# Altium schematic sheet schema.SchDoc
size A4
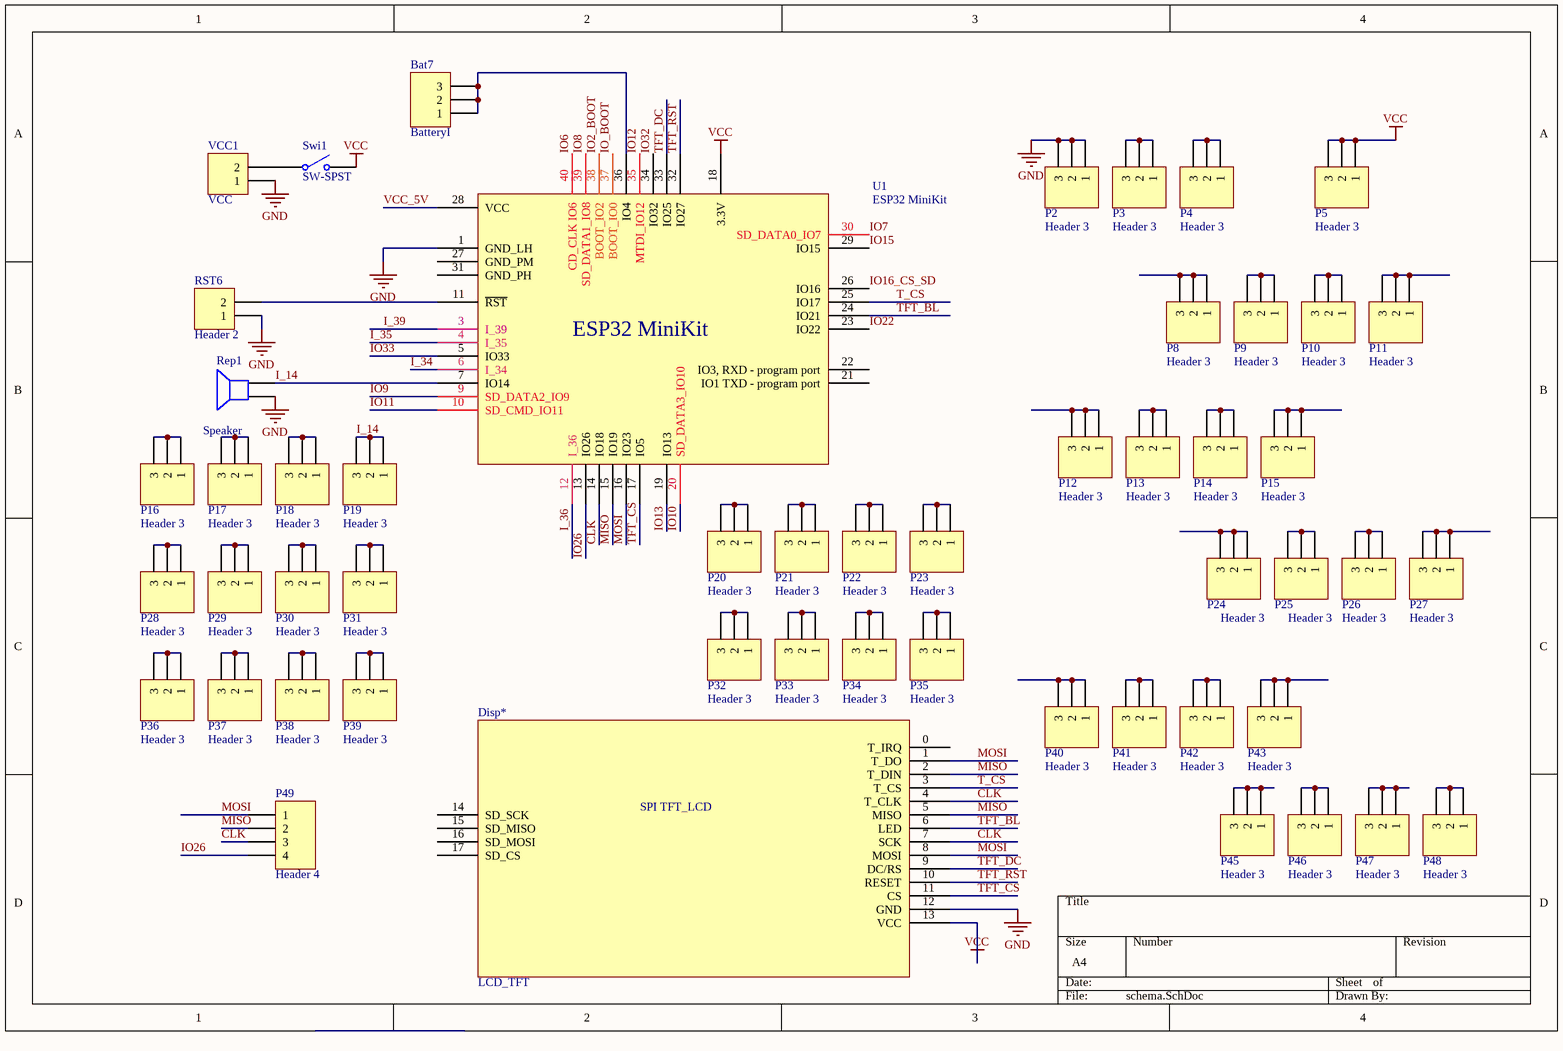
[diagram p0: schema.SchDoc]

## Parts
Bat7  BatteryI  [HDR1X3]
Disp*  LCD_TFT  [TCT_SPI_480x320 ST7796]
P2  Header 3  [HDR1X3]
P3  Header 3  [HDR1X3]
P4  Header 3  [HDR1X3]
P5  Header 3  [HDR1X3]
P8  Header 3  [HDR1X3]
P9  Header 3  [HDR1X3]
P10  Header 3  [HDR1X3]
P11  Header 3  [HDR1X3]
P12  Header 3  [HDR1X3]
P13  Header 3  [HDR1X3]
P14  Header 3  [HDR1X3]
P15  Header 3  [HDR1X3]
P16  Header 3  [HDR1X3]
P17  Header 3  [HDR1X3]
P18  Header 3  [HDR1X3]
P19  Header 3  [HDR1X3]
P20  Header 3  [HDR1X3]
P21  Header 3  [HDR1X3]
P22  Header 3  [HDR1X3]
P23  Header 3  [HDR1X3]
P24  Header 3  [HDR1X3]
P25  Header 3  [HDR1X3]
P26  Header 3  [HDR1X3]
P27  Header 3  [HDR1X3]
P28  Header 3  [HDR1X3]
P29  Header 3  [HDR1X3]
P30  Header 3  [HDR1X3]
P31  Header 3  [HDR1X3]
P32  Header 3  [HDR1X3]
P33  Header 3  [HDR1X3]
P34  Header 3  [HDR1X3]
P35  Header 3  [HDR1X3]
P36  Header 3  [HDR1X3]
P37  Header 3  [HDR1X3]
P38  Header 3  [HDR1X3]
P39  Header 3  [HDR1X3]
P40  Header 3  [HDR1X3]
P41  Header 3  [HDR1X3]
P42  Header 3  [HDR1X3]
P43  Header 3  [HDR1X3]
P45  Header 3  [HDR1X3]
P46  Header 3  [HDR1X3]
P47  Header 3  [HDR1X3]
P48  Header 3  [HDR1X3]
P49  Header 4  [HDR1X4]
Rep1  Speaker  [PIN2]
RST6  Header 2  [HDR1X2]
Swi1  SW-SPST  [SPST-2]
U1  ESP32 MiniKit  [esp32]
VCC1  VCC  [HDR1X2]

## Nets
GND: Disp*.12(GND) P2.1 P2.2 P2.3 Rep1.1 RST6.1 U1.1(GND_LH) VCC1.1
VCC: Disp*.13(VCC) P5.1 P5.2 P5.3 Swi1.2(NO) U1.18(3.3V)
CLK: Disp*.4(T_CLK) Disp*.7(SCK) P49.3 U1.14(IO18)
I_14: P19.1 P19.2 P19.3 Rep1.2 U1.7(IO14)
I_34: U1.6(I_34)
I_35: U1.4(I_35)
I_36: U1.12(I_36)
I_39: U1.3(I_39)
IO2_BOOT: U1.38(BOOT_IO2)
IO6: U1.40(CD_CLK_IO6)
IO7: U1.30(SD_DATA0_IO7)
IO8: U1.39(SD_DATA1_IO8)
IO9: U1.9(SD_DATA2_IO9)
IO10: U1.20(SD_DATA3_IO10)
IO11: U1.10(SD_CMD_IO11)
IO12: U1.35(MTDI_IO12)
IO13: U1.19(IO13)
IO15: U1.29(IO15)
IO16_CS_SD: U1.26(IO16)
IO22: U1.23(IO22)
IO26: P49.4 U1.13(IO26)
IO32: U1.34(IO32)
IO33: U1.5(IO33)
IO_BOOT: U1.37(BOOT_IO0)
MISO: Disp*.2(T_DIN) Disp*.5(MISO) P49.2 U1.15(IO19)
MOSI: Disp*.1(T_DO) Disp*.8(MOSI) P49.1 U1.16(IO23)
T_CS: Disp*.3(T_CS) U1.25(IO17)
TFT_BL: Disp*.6(LED) U1.24(IO21)
TFT_CS: Disp*.11(CS) U1.17(IO5)
TFT_DC: Disp*.9(DC/RS) U1.33(IO25)
TFT_RST: Disp*.10(RESET) U1.32(IO27)
VCC_5V: U1.28(VCC)
NetBat7_1: Bat7.1 Bat7.2 Bat7.3 U1.36(IO4)
NetP3_1: P3.1 P3.2 P3.3
NetP4_1: P4.1 P4.2 P4.3
NetP8_1: P8.1 P8.2 P8.3
NetP9_1: P9.1 P9.2 P9.3
NetP10_1: P10.1 P10.2 P10.3
NetP11_1: P11.1 P11.2 P11.3
NetP12_1: P12.1 P12.2 P12.3
NetP13_1: P13.1 P13.2 P13.3
NetP14_1: P14.1 P14.2 P14.3
NetP15_1: P15.1 P15.2 P15.3
NetP16_1: P16.1 P16.2 P16.3
NetP17_1: P17.1 P17.2 P17.3
NetP18_1: P18.1 P18.2 P18.3
NetP20_1: P20.1 P20.2 P20.3
NetP21_1: P21.1 P21.2 P21.3
NetP22_1: P22.1 P22.2 P22.3
NetP23_1: P23.1 P23.2 P23.3
NetP24_1: P24.1 P24.2 P24.3
NetP25_1: P25.1 P25.2 P25.3
NetP26_1: P26.1 P26.2 P26.3
NetP27_1: P27.1 P27.2 P27.3
NetP28_1: P28.1 P28.2 P28.3
NetP29_1: P29.1 P29.2 P29.3
NetP30_1: P30.1 P30.2 P30.3
NetP31_1: P31.1 P31.2 P31.3
NetP32_1: P32.1 P32.2 P32.3
NetP33_1: P33.1 P33.2 P33.3
NetP34_1: P34.1 P34.2 P34.3
NetP35_1: P35.1 P35.2 P35.3
NetP36_1: P36.1 P36.2 P36.3
NetP37_1: P37.1 P37.2 P37.3
NetP38_1: P38.1 P38.2 P38.3
NetP39_1: P39.1 P39.2 P39.3
NetP40_1: P40.1 P40.2 P40.3
NetP41_1: P41.1 P41.2 P41.3
NetP42_1: P42.1 P42.2 P42.3
NetP43_1: P43.1 P43.2 P43.3
NetP45_1: P45.1 P45.2 P45.3
NetP46_1: P46.1 P46.2 P46.3
NetP47_1: P47.1 P47.2 P47.3
NetP48_1: P48.1 P48.2 P48.3
NetRST6_2: RST6.2 U1.11(~{RST})
NetSwi1_1: Swi1.1(COMMON) VCC1.2

Not connected (* = marked no-connect by the designer): Disp* 0(T_IRQ) 14(SD_SCK) 15(SD_MISO) 16(SD_MOSI) 17(SD_CS); U1 2(NC) 8(NC) 21(IO1_TXD_-_program_port) 22(IO3,_RXD_-_program_port) 27(GND_PM) 31(GND_PH)

## Notes on the sheet
- (in symbol 480x320_tft_SPI_LCD) SPI TFT_LCD

## Library data of the parts
Bat7 P2-P5 P8-P43 P45-P48 = Header 3: Header, 3-Pin; LatestRevisionDate: 17-Jul-2002; LatestRevisionNote: Re-released for DXP Platform.; Publisher: Altium Limited
Disp* = 480x320_tft_SPI_LCD: pin to pad: 0>1 1>2 2>3 3>4 4>5 5>6 6>7 7>8 8>9 9>10 10>11 11>12 12>13 13>14 14>15 15>16 16>17 17>18
P49 = Header 4: Header, 4-Pin; LatestRevisionDate: 17-Jul-2002; LatestRevisionNote: Re-released for DXP Platform.; Publisher: Altium Limited
Rep1 = Speaker: Loudspeaker; Published: 24-Mar-1999; LatestRevisionDate: 17-Jul-2002; LatestRevisionNote: Re-released for DXP Platform.; PackageReference: PIN2; Publisher: Altium Limited
RST6 VCC1 = Header 2: Header, 2-Pin; LatestRevisionDate: 17-Jul-2002; LatestRevisionNote: Re-released for DXP Platform.; Publisher: Altium Limited
Swi1 = SW-SPST: Single-Pole, Single-Throw Switch; Published: 24-Mar-1999; LatestRevisionDate: 17-Jul-2002; LatestRevisionNote: Re-released for DXP Platform.; PackageReference: SPST-2; Publisher: Altium Limited; PackageDescription: Switch; 2 Leads
U1 = ESP32 Wemos